# Altium schematic sheet Priemnic.SchDoc
size A4
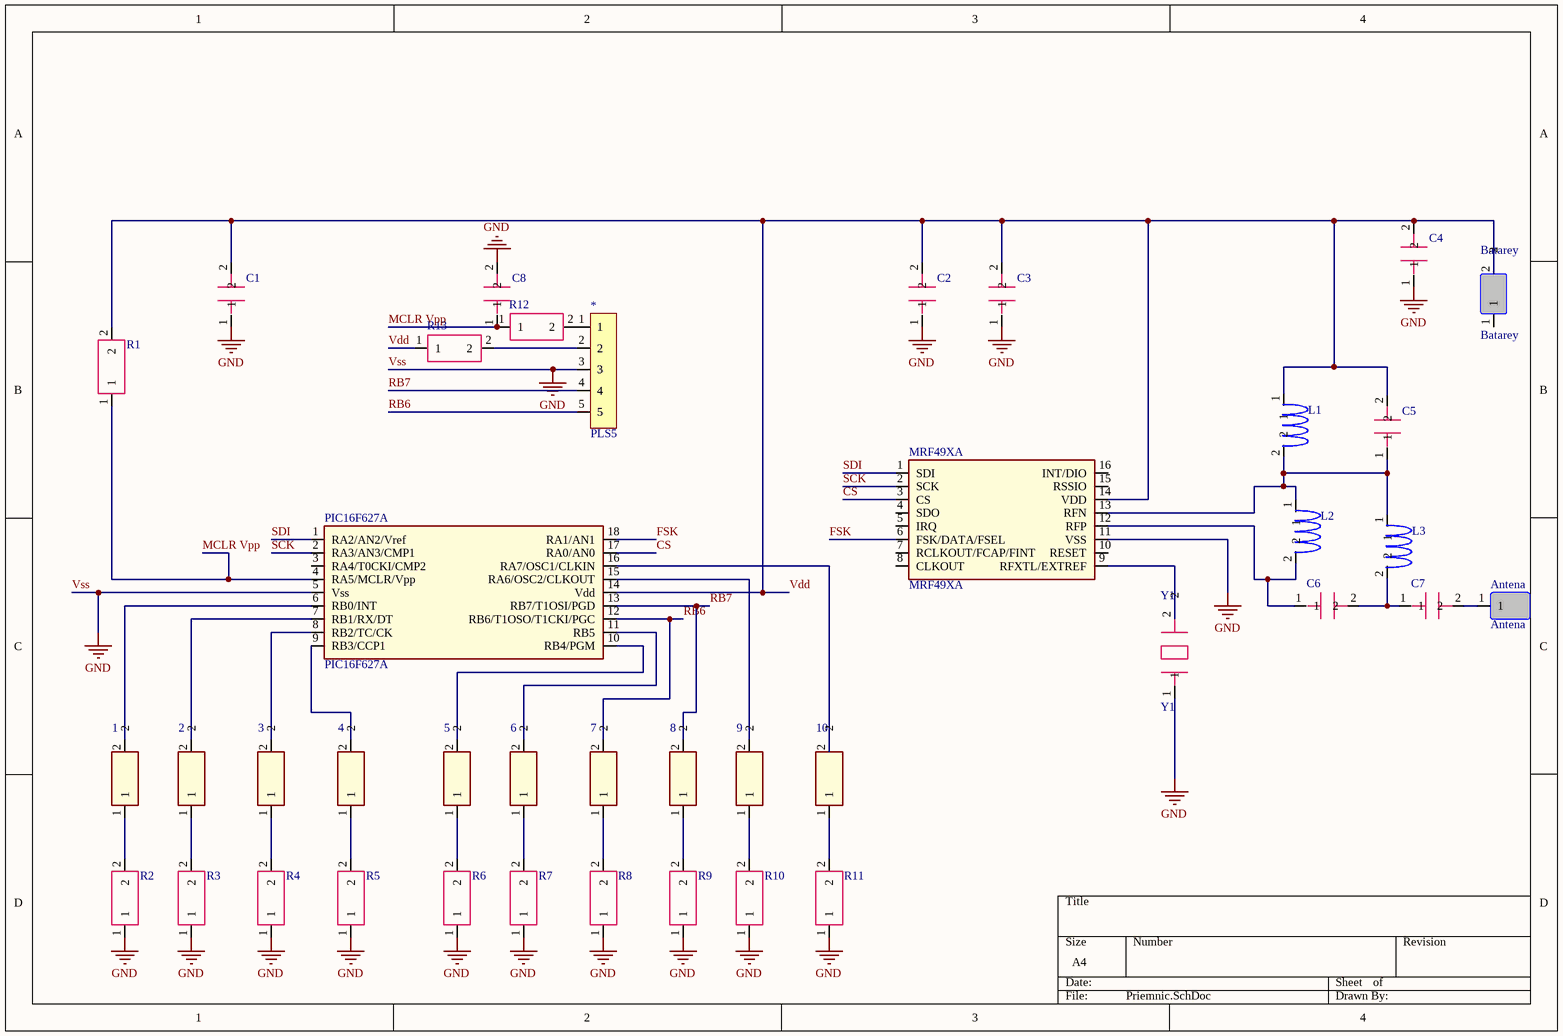
[diagram p0: Priemnic.SchDoc]

## Parts
1  (no value)  [Light-emitting diode]
2  (no value)  [Light-emitting diode]
3  (no value)  [Light-emitting diode]
4  (no value)  [Light-emitting diode]
5  (no value)  [Light-emitting diode]
6  (no value)  [Light-emitting diode]
7  (no value)  [Light-emitting diode]
8  (no value)  [Light-emitting diode]
9  (no value)  [Light-emitting diode]
10  (no value)  [Light-emitting diode]
*  PLS5  [PLS5]
Antena  Antena  [Anteny]
Batarey  Batarey  [Batarey]
C1  (no value)  [С0805]
C2  (no value)  [С0805]
C3  (no value)  [С0805]
C4  (no value)  [С0805]
C5  (no value)  [С0805]
C6  (no value)  [С0805]
C7  (no value)  [С0805]
C8  (no value)  [С0805]
L1  (no value)  [L?]
L2  (no value)  [L?]
L3  (no value)  [L?]
MRF49XA  MRF49XA  [MRF49XA]
PIC16F627A  PIC16F627A  [PIC16F627A]
R1  (no value)  [R0805]
R2  (no value)  [R0805]
R3  (no value)  [R0805]
R4  (no value)  [R0805]
R5  (no value)  [R0805]
R6  (no value)  [R0805]
R7  (no value)  [R0805]
R8  (no value)  [R0805]
R9  (no value)  [R0805]
R10  (no value)  [R0805]
R11  (no value)  [R0805]
R12  (no value)  [R0805]
R13  (no value)  [R0805]
Y1  Y1  [Quartz]

## Nets
Vss: *.3 C1.1 C2.1 C3.1 C4.1 C8.2 MRF49XA.11(VSS) PIC16F627A.5(Vss) R2.1 R3.1 R4.1 R5.1 R6.1 R7.1 R8.1 R9.1 R10.1 R11.1 Y1.1  [also labelled GND]
CS: MRF49XA.3(CS) PIC16F627A.17(RA0/AN0)
FSK: MRF49XA.6(FSK/DATA/FSEL) PIC16F627A.18(RA1/AN1)
MCLR Vpp: C8.1 PIC16F627A.4(RA5/MCLR/Vpp) R1.1 R12.1
RB6: *.5 PIC16F627A.12(RB6/T1OSO/T1CKI/PGC)
RB7: *.4 PIC16F627A.13(RB7/T1OSI/PGD)
SCK: MRF49XA.2(SCK) PIC16F627A.2(RA3/AN3/CMP1)
SDI: MRF49XA.1(SDI) PIC16F627A.1(RA2/AN2/Vref)
Vdd: Batarey.2 C1.2 C2.2 C3.2 C4.2 C5.2 L1.1 MRF49XA.14(VDD) PIC16F627A.14(Vdd) R1.2 R13.1
Net1_1: 1.1 R2.2
Net2_1: 2.1 R3.2
Net3_1: 3.1 R4.2
Net4_1: 4.1 R5.2
Net5_1: 5.1 R6.2
Net6_1: 6.1 R7.2
Net7_1: 7.1 R8.2
Net8_1: 8.1 R9.2
Net9_1: 9.1 R10.2
Net10_1: 10.1 R11.2
Net10_2: 10.2 PIC16F627A.16(RA7/OSC1/CLKIN)
Net*_1: *.1 R12.2
Net*_2: *.2 R13.2
NetAntena_1: Antena.1 C7.2
NetC5_1: C5.1 L1.2 L2.1 L3.1 MRF49XA.13(RFN)
NetC6_1: C6.1 L2.2 MRF49XA.12(RFP)
NetC6_2: C6.2 C7.1 L3.2
NetMRF49XA_9: MRF49XA.9(RFXTL/EXTREF) Y1.2

Not connected (* = marked no-connect by the designer): 1 2; 2 2; 3 2; 4 2; 5 2; 6 2; 7 2; 8 2; 9 2; Batarey 1; MRF49XA 4(SDO) 5(IRQ) 7(RCLKOUT/FCAP/FINT) 8(CLKOUT) 10(RESET) 15(RSSIO) 16(INT/DIO); PIC16F627A 3(RA4/T0CKI/CMP2) 6(RB0/INT) 7(RB1/RX/DT) 8(RB2/TC/CK) 9(RB3/CCP1) 10(RB4/PGM) 11(RB5) 15(RA6/OSC2/CLKOUT)

## Library data of the parts
1-10 = Light-emitting diode
C1-C8 = Capacity
L1-L3 = Inductance
R1-R13 = Rezistor
Y1 = Quartz